# EAGLE design mcu (EAGLE 7.3.0)
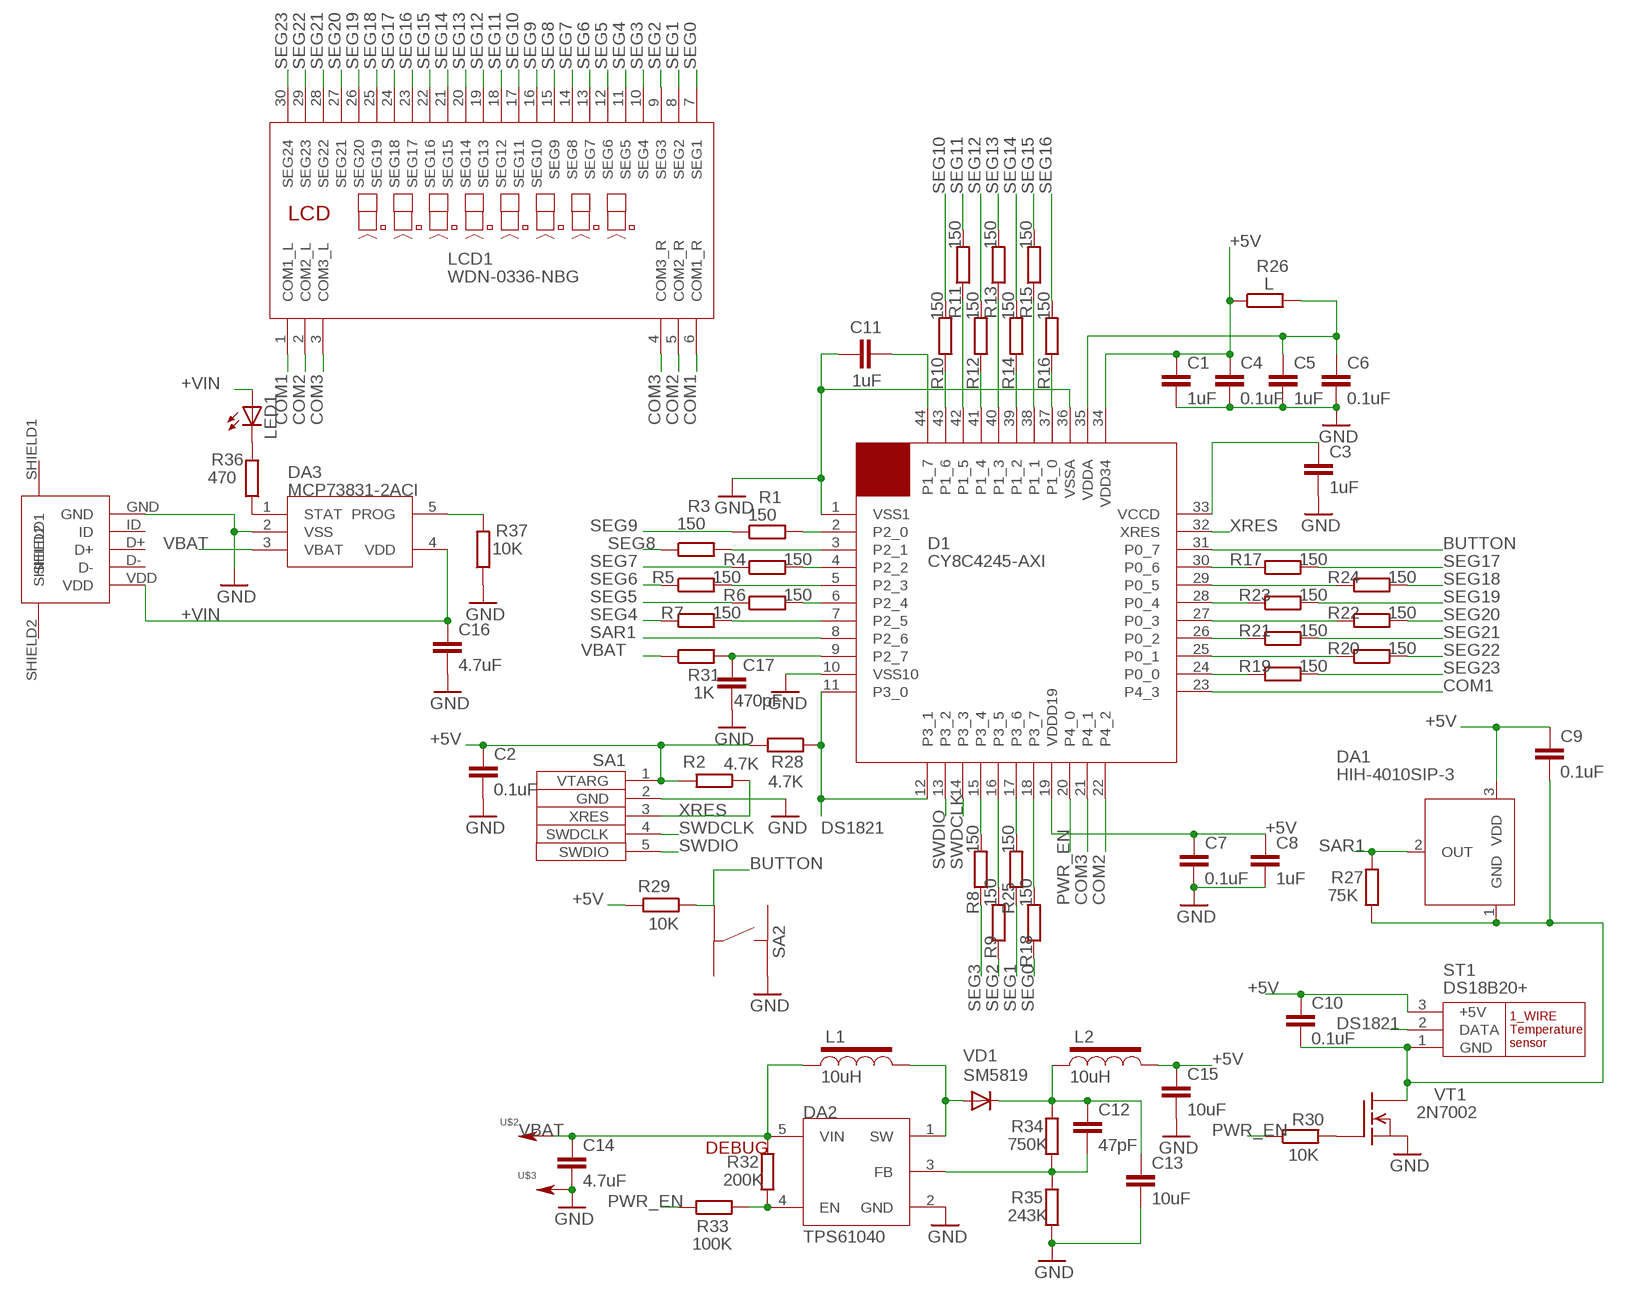
[diagram p0: schematic, sheet 1]

## Parts
C1  1uF  C-EUC0603  [C0603]
C2  0.1uF  C-EUC0603  [C0603]
C3  1uF  C-EUC0603  [C0603]
C4  0.1uF  C-EUC0603  [C0603]
C5  1uF  C-EUC0603  [C0603]
C6  0.1uF  C-EUC0603  [C0603]
C7  0.1uF  C-EUC0603  [C0603]
C8  1uF  C-EUC0603  [C0603]
C9  0.1uF  C-EUC0603  [C0603]
C10  0.1uF  C-EUC0603  [C0603]
C11  1uF  C-EUC0603  [C0603]
C12  47pF  C-EUC0805  [C0805]
C13  10uF  C-EUC0805  [C0805]
C14  4.7uF  C-EUC0805  [C0805]
C15  10uF  C-EUC0805  [C0805]
C16  4.7uF  C-EUC0805  [C0805]
C17  470pF  C-EUC0603  [C0603]
D1  CY8C4245-AXI  CY8C4245-AXITQFP44  [TQFP44]
DA1  HIH-4010SIP-3  [SIP-3]
DA2  TPS61040  [SOT23-5L]
DA3  MCP73831-2ACI  MCP73831SOT23-5  [SOT23-5L]
L1  10uH  INDUCTOR453226  [SQC453226]
L2  10uH  INDUCTOR453226  [SQC453226]
LCD1  WDN-0336-NBG  WDN0336HOLE  [WDN0336]
LED1  LEDSMT1206  [1206]
R1  150  R-EU_R0603  [R0603]
R2  4.7K  R-EU_R0603  [R0603]
R3  150  R-EU_R0603  [R0603]
R4  150  R-EU_R0603  [R0603]
R5  150  R-EU_R0603  [R0603]
R6  150  R-EU_R0603  [R0603]
R7  150  R-EU_R0603  [R0603]
R8  150  R-EU_R0603  [R0603]
R9  150  R-EU_R0603  [R0603]
R10  150  R-EU_R0603  [R0603]
R11  150  R-EU_R0603  [R0603]
R12  150  R-EU_R0603  [R0603]
R13  150  R-EU_R0603  [R0603]
R14  150  R-EU_R0603  [R0603]
R15  150  R-EU_R0603  [R0603]
R16  150  R-EU_R0603  [R0603]
R17  150  R-EU_R0603  [R0603]
R18  150  R-EU_R0603  [R0603]
R19  150  R-EU_R0603  [R0603]
R20  150  R-EU_R0603  [R0603]
R21  150  R-EU_R0603  [R0603]
R22  150  R-EU_R0603  [R0603]
R23  150  R-EU_R0603  [R0603]
R24  150  R-EU_R0603  [R0603]
R25  150  R-EU_R0603  [R0603]
R26  L  R-EU_R0805  [R0805]
R27  75K  R-EU_R0603  [R0603]
R28  4.7K  R-EU_R0603  [R0603]
R29  10K  R-EU_R0603  [R0603]
R30  10K  R-EU_R0603  [R0603]
R31  1K  R-EU_R0603  [R0603]
R32  200K  R-EU_R0603  [R0603]
R33  100K  R-EU_R0603  [R0603]
R34  750K  R-EU_R0805  [R0805]
R35  243K  R-EU_R0805  [R0805]
R36  470  R-EU_R1206  [R1206]
R37  10K  R-EU_R0603  [R0603]
SA1  SWDSWD-5  [SWD-5]
SA2  TACKT_BUTTONIIT-1102S  [IIT-1102S]
ST1  DS18B20+  DS18B20TO92  [TO92-]
U$1  USB-MICRO  [USB-MICRO-SMD]
U$2  1-PINHOME  [1-PIN_HOME]
U$3  1-PIN2_54  [1_PIN_2_54]
VD1  SM5819  SM5819MELF  [MELF-MLL41]
VT1  2N7002  [SOT23]

## Nets
+5V: C1.1 C2.1 C4.1 C7.1 C8.1 C9.1 C10.1 C15.1 D1.19(VDDD19) D1.34(VDD34) DA1.3(VDD) L2.2(L2) R2.2 R26.1 R28.2 R29.2 SA1.1(VTARG) ST1.3(+5V)
+VIN: C16.1 DA3.4(VDD) LED1.A U$1.VDD
BUTTON: D1.31(P0_7) R29.1 SA2.SSR
COM1: D1.23(P4_3) LCD1.1(COM1_L) LCD1.6(COM1_R)
COM2: D1.22(P4_2) LCD1.2(COM2_L) LCD1.5(COM2_R)
COM3: D1.21(P4_1) LCD1.3(COM3_L) LCD1.4(COM3_R)
DS1821: D1.11(P3_0) D1.12(P3_1) R28.1 ST1.2(DATA)
GND: C1.2 C2.2 C3.2 C4.2 C5.2 C6.2 C7.2 C8.2 C11.1 C13.2 C14.2 C15.2 C16.2 C17.2 D1.1(VSS1) D1.10(VSS10) D1.36(VSSA) DA2.2(GND) DA3.2(VSS) R35.1 R37.1 SA1.2(GND) SA2.SL U$1.GND U$3.P$1(S) VT1.2(S)
N$1: D1.2(P2_0) R1.2
N$2: D1.4(P2_2) R4.2
N$3: D1.6(P2_4) R6.2
N$4: D1.15(P3_4) R8.2
N$5: D1.3(P2_1) R3.2
N$6: D1.5(P2_3) R5.2
N$7: D1.7(P2_5) R7.2
N$8: D1.43(P1_6) R10.1
N$9: C3.1 D1.33(VCCD)
N$10: D1.42(P1_5) R11.1
N$11: D1.41(P1_4) R12.1
N$12: C5.1 C6.1 D1.35(VDDA) R26.2
N$13: D1.40(P1_3) R13.1
N$14: D1.39(P1_2) R14.1
N$15: D1.38(P1_1) R15.1
N$16: D1.37(P1_0) R16.1
N$17: D1.30(P0_6) R17.1
N$18: D1.29(P0_5) R24.1
N$19: D1.28(P0_4) R23.1
N$20: D1.16(P3_5) R9.2
N$21: D1.17(P3_6) R25.2
N$22: D1.18(P3_7) R18.2
N$23: D1.27(P0_3) R22.1
N$24: D1.26(P0_2) R21.1
N$25: D1.25(P0_1) R20.1
N$26: D1.24(P0_0) R19.1
N$27: C11.2 D1.44(P1_7)
N$28: C9.2 C10.2 DA1.1(GND) R27.1 ST1.1(GND) VT1.3(D)
N$29: R30.2 VT1.1(G)
N$30: C12.2 DA2.3(FB) R34.1 R35.2
N$31: DA2.4(EN) R32.1 R33.2
N$32: DA2.1(SW) L1.2(L2) VD1.A
N$33: C12.1 C13.1 L2.1(L1) R34.2 VD1.C
N$34: DA3.1(STAT) R36.1
N$37: LED1.C R36.2
N$38: DA3.5(PROG) R37.2
PWR_EN: D1.20(P4_0) R30.1 R33.1
SAR1: D1.8(P2_6) DA1.2(OUT) R27.2
SAR2: C17.1 D1.9(P2_7) R31.2
SEG0: LCD1.7(SEG1) R18.1
SEG1: LCD1.8(SEG2) R25.1
SEG2: LCD1.9(SEG3) R9.1
SEG3: LCD1.10(SEG4) R8.1
SEG4: LCD1.11(SEG5) R7.1
SEG5: LCD1.12(SEG6) R6.1
SEG6: LCD1.13(SEG7) R5.1
SEG7: LCD1.14(SEG8) R4.1
SEG8: LCD1.15(SEG9) R3.1
SEG9: LCD1.16(SEG10) R1.1
SEG10: LCD1.17(SEG11) R10.2
SEG11: LCD1.18(SEG12) R11.2
SEG12: LCD1.19(SEG13) R12.2
SEG13: LCD1.20(SEG14) R13.2
SEG14: LCD1.21(SEG15) R14.2
SEG15: LCD1.22(SEG16) R15.2
SEG16: LCD1.23(SEG17) R16.2
SEG17: LCD1.24(SEG18) R17.2
SEG18: LCD1.25(SEG19) R24.2
SEG19: LCD1.26(SEG20) R23.2
SEG20: LCD1.27(SEG21) R22.2
SEG21: LCD1.28(SEG22) R21.2
SEG22: LCD1.29(SEG23) R20.2
SEG23: LCD1.30(SEG24) R19.2
SWDCLK: D1.14(P3_3) SA1.4(SWDCLK)
SWDIO: D1.13(P3_2) SA1.5(SWDIO)
VBAT: C14.1 DA2.5(VIN) DA3.3(VBAT) L1.1(L1) R31.1 R32.2 U$2.P$1(S)
XRES: D1.32(XRES) R2.1 SA1.3(XRES)
Unconnected: SA2.SR SA2.SSL U$1.D+ U$1.D- U$1.ID U$1.SHIELD1 U$1.SHIELD2

## Notes on the sheet
- DEBUG

## Library data of the parts
C1-C17 = resistors:C-EU: CAPACITOR, European symbol
D1 = cypress:CY8C4245-AXI
DA1 = Sensors:HIH-4010
DA2 = power:TPS61040
DA3 = power:MCP73831
L1 L2 = inductors:INDUCTOR
LCD1 = lcd:WDN0336
LED1 = led:LED: LED OSRAM: - CHIPLED LG R971, LG N971, LY N971, LG Q971, LY Q971, LO R971, LY R971 LH N974, LH R974 LS Q976, LO Q976, LY Q976 LO Q996 - Hyper CHIPLED LW Q18S LB Q993, LB Q99A, LB R99A - SideLED LS A670, LO A670, LY A670, LG A670, LP A670 LB A673, LV A673, LT A673, LW A673 LH A674 LY A675 LS A676, LA A676, LO A676, LY A676, LW A676 LS A679, LY A679, LG A679 - Hyper Micro SIDELED® LS Y876, LA Y876, LO Y876, LY Y876 LT Y87S - SmartLED LW L88C, LW L88S LB L89C, LB L89S, LG L890 LS L89K, LO L89K, LY L89K LS L896, LA L896, LO L896, LY L896 - TOPLED LS T670, LO T670, LY T670, LG T670, LP T670 LSG T670, LSP T670, LSY T670, LOP T670, LYG T670 LG T671, LOG T671, LSG T671 LB T673, LV T673, LT T673, LW T673 LH T674 LS T676, LA T676, LO T676, LY T676, LB T676, LH T676, LSB T676, LW T676 LB T67C, LV T67C, LT T67C, LS T67K, LO T67K, LY T67K, LW E67C LS E67B, LA E67B, LO E67B, LY E67B, LB E67C, LV E67C, LT E67C LW T67C LS T679, LY T679, LG T679 LS T770, LO T770, LY T770, LG T770, LP T770 LB T773, LV T773, LT T773, LW T773 LH T774 LS E675, LA E675, LY E675, LS T675 LS T776, LA T776, LO T776, LY T776, LB T776 LHGB T686 LT T68C, LB T68C - Hyper Mini TOPLED® LB M676 - Mini TOPLED Santana® LG M470 LS M47K, LO M47K, LY M47K Source: http://www.osram.convergy.de LUXEON: - LUMILED® LXK2-PW12-R00, LXK2-PW12-S00, LXK2-PW14-U00, LXK2-PW14-V00 LXK2-PM12-R00, LXK2-PM12-S00, LXK2-PM14-U00 LXK2-PE12-Q00, LXK2-PE12-R00, LXK2-PE12-S00, LXK2-PE14-T00, LXK2-PE14-U00 LXK2-PB12-K00, LXK2-PB12-L00, LXK2-PB12-M00, LXK2-PB14-N00, LXK2-PB14-P00, LXK2-PB14-Q00 LXK2-PR12-L00, LXK2-PR12-M00, LXK2-PR14-Q00, LXK2-PR14-R00 LXK2-PD12-Q00, LXK2-PD12-R00, LXK2-PD12-S00 LXK2-PH12-R00, LXK2-PH12-S00 LXK2-PL12-P00, LXK2-PL12-Q00, LXK2-PL12-R00 Source: www.luxeon.com KINGBRIGHT: KA-3528ASYC Source: www.kingbright.com
R1-R37 = resistors:R-EU_: RESISTOR, European symbol
SA1 = cypress:SWD
SA2 = button:TACKT_BUTTON
ST1 = Sensors:DS18B20
U$1 = connectors:USB-MICRO
U$2 U$3 = connectors:1-PIN
VD1 = diodes:SM5819
VT1 = Tranzistors:2N7002

## Board
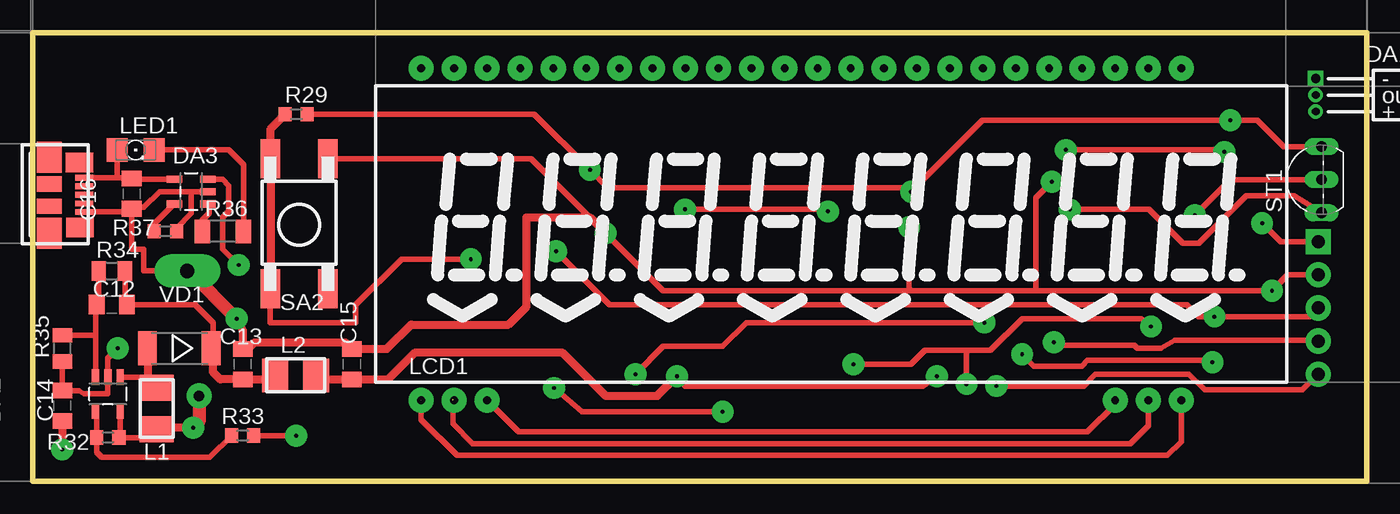
[diagram p1: board, top side]
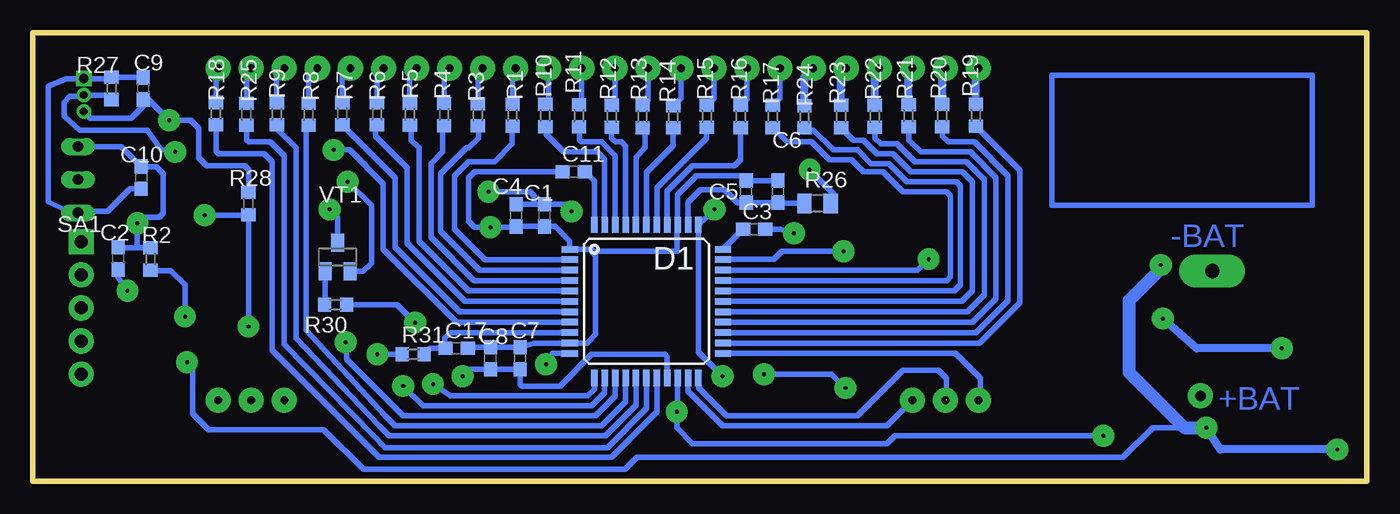
[diagram p2: board, bottom side, seen from below]

Size 102.55 x 34.47 mm. Coordinates in mm from the lower left corner, seen from the top.
Outline: 102.55,34.47 0,34.47 0,0 102.55,0 102.55,34.47
Copper layers (1*16): Top 0.035mm / dielectric 1.5mm / Bottom 0.035mm
Design rules "default": minimum track width 10mil, minimum drill 24mil, track to track 8mil, track to pad 8mil, pad to pad 8mil, via to via 8mil, smd to smd 8mil, copper to edge 40mil, drill to drill 8mil, minimum pad ring 10mil, minimum via ring 8mil, stop-mask expansion 4mil, vias tented up to drill 0mil, thermal gap 10mil

### Footprints (pad centres in the part's own frame; a part is rotated, then mirrored left to right if it is on the bottom)
C0603 = smd 1.1 x 1: 1 -0.85,0; 2 0.85,0
C0805 = smd 1.2 x 1.5: 1 -1.167,0; 2 1.167,0
TQFP44 = smd 1.25 x 0.5: 1 -5.879,4; 2 -5.879,3.2; 3 -5.879,2.4; 4 -5.879,1.6; 5 -5.879,0.8; 6 -5.879,0; 7 -5.879,-0.8; 8 -5.879,-1.6; 9 -5.879,-2.4; 10 -5.879,-3.2; 11 -5.879,-4; 23 5.879,-4; 24 5.879,-3.2; 25 5.879,-2.4; 26 5.879,-1.6; 27 5.879,-0.8; 28 5.879,0; 29 5.879,0.8; 30 5.879,1.6; 31 5.879,2.4; 32 5.879,3.2; 33 5.879,4 | smd 0.5 x 1.25: 12 -4,-5.879; 13 -3.2,-5.879; 14 -2.4,-5.879; 15 -1.6,-5.879; 16 -0.8,-5.879; 17 0,-5.879; 18 0.8,-5.879; 19 1.6,-5.879; 20 2.4,-5.879; 21 3.2,-5.879; 22 4,-5.879; 34 4,5.879; 35 3.2,5.879; 36 2.4,5.879; 37 1.6,5.879; 38 0.8,5.879; 39 0,5.879; 40 -0.8,5.879; 41 -1.6,5.879; 42 -2.4,5.879; 43 -3.2,5.879; 44 -4,5.879
SIP-3 = drill 0.7 pad 1 square: 1 0,0 | drill 0.6 pad 1: 2 0,-1.27; 3 0,-2.54
SOT23-5L = smd 0.55 x 1.2: 1 -0.95,-1.3; 2 0,-1.3; 3 0.95,-1.3; 4 0.95,1.3; 5 -0.95,1.3
SQC453226 = smd 2 x 2.6: 1 0.953,1.27; 2 4.128,1.27
WDN0336 = drill 0.6 pad 1.93: 1 3.493,0.535; 2 6.032,0.535; 3 8.572,0.535; 4 56.833,0.535; 5 59.373,0.535; 6 61.913,0.535; 7 61.913,26.035; 8 59.373,26.035; 9 56.833,26.035; 10 54.292,26.035; 11 51.752,26.035; 12 49.212,26.035; 13 46.672,26.035; 14 44.133,26.035; 15 41.593,26.035; 16 39.053,26.035; 17 36.513,26.035; 18 33.972,26.035; 19 31.433,26.035; 20 28.892,26.035; 21 26.352,26.035; 22 23.812,26.035; 23 21.273,26.035; 24 18.733,26.035; 25 16.192,26.035; 26 13.652,26.035; 27 11.113,26.035; 28 8.572,26.035; 29 6.032,26.035; 30 3.493,26.035
1206 = smd 1.6 x 1.803: A -1.422,0; C 1.422,0
R0603 = smd 1 x 1.1: 1 -0.85,0; 2 0.85,0
R0805 = smd 1.1 x 1.5: 1 -1.009,0; 2 1.009,0
R1206 = smd 1.2 x 1.803: 1 -1.581,0; 2 1.581,0
SWD-5 = drill 1 pad 1.93 square: 1 0,0 | drill 1 pad 1.93: 2 2.54,0; 3 5.08,0; 4 7.62,0; 5 10.16,0
IIT-1102S = smd 3 x 1.5: SL 10.001,0; SR 0,0; SSL 0,4.445; SSR 10.001,4.445
TO92- = drill 0.813 long: 1 -2.54,0; 2 0,0; 3 2.54,0
USB-MICRO-SMD = smd 1.38 x 0.45: D+ 0,-1.627; D- 0,-0.972; GND 0,-2.937; ID 0,-2.282; VDD 0,-0.318 | smd 2.1 x 1.5: P$1 -0.318,-4.128; P$2 -0.357,0.853 | smd 1.9 x 1.175: P$5 -2.679,-2.5; P$6 -2.679,-0.794 | smd 1.9 x 2.375: SHIELD1 -2.679,1.27; SHIELD2 -2.679,-4.564
1-PIN_HOME = drill 0.8 pad 1.93: P$1 0,0
1_PIN_2_54 = drill 1.1 pad 2.54 long: P$1 0,0
MELF-MLL41 = smd 1.45 x 2.6: A 2.445,0; C -2.445,0
SOT23 = smd 1 x 1.4: 1 -0.95,-1.1; 2 0.95,-1.1; 3 0,1.1

### Placement (x,y rotation side)
C1  63.2,20.42 270 bottom
C2  95.96,17.12 270 bottom
C3  47.09,19.35 0 bottom
C4  65.38,20.42 270 bottom
C5  47.7,22.25 90 bottom
C6  45.26,22.25 90 bottom
C7  65.07,9.45 90 bottom
C8  67.36,9.45 90 bottom
C9  94.03,30.18 90 bottom
C10  94.18,23.32 270 bottom
C11  60.96,23.77 0 bottom
C12  6.1,13.56 180 top
C13  16.15,8.99 90 top
C14  2.29,5.79 90 top
C15  24.54,8.99 90 top
C16  7.62,22.1 270 top
C17  69.95,10.21 0 bottom
D1  55.37,13.82 0 bottom
DA1  98.6,30.94 0 top
DA2  5.79,6.71 180 top
DA3  12.19,22.25 90 top
L1  10.82,3.05 90 top
L2  17.68,6.86 0 top
LCD1  26.37,5.69 0 top
LED1  7.92,25.45 0 top
R1  65.66,28.12 270 bottom
R2  93.47,17.07 90 bottom
R3  68.33,28.14 270 bottom
R4  70.92,28.17 270 bottom
R5  73.56,28.19 270 bottom
R6  76.07,28.22 270 bottom
R7  78.74,28.24 270 bottom
R8  81.33,28.19 270 bottom
R9  83.77,28.22 270 bottom
R10  63.14,28.09 90 bottom
R11  60.55,28.07 90 bottom
R12  58.04,28.04 90 bottom
R13  55.68,28.02 90 bottom
R14  53.31,27.99 90 bottom
R15  50.72,28.04 90 bottom
R16  48.13,28.02 90 bottom
R17  45.67,28.02 90 bottom
R18  88.44,28.24 270 bottom
R19  30.05,28.12 90 bottom
R20  32.64,28.09 90 bottom
R21  35.23,28.07 90 bottom
R22  37.82,28.04 90 bottom
R23  40.41,28.02 90 bottom
R24  43.23,27.99 90 bottom
R25  86.11,28.19 270 bottom
R26  42.21,21.34 180 bottom
R27  96.47,30.18 270 bottom
R28  85.95,21.34 90 bottom
R29  20.27,28.19 0 top
R30  79.25,13.56 180 bottom
R31  73.3,9.75 0 bottom
R32  5.79,3.35 0 top
R33  16.15,3.51 180 top
R34  6.1,16.15 0 top
R35  2.29,10.21 90 top
R36  14.63,19.2 0 top
R37  10.21,19.2 180 top
SA1  98.81,18.39 270 bottom
SA2  22.71,14.78 90 top
ST1  99.06,23.16 90 top
U$1  3.96,23.62 0 top
U$2  12.8,6.55 0 top
U$3  11.89,16.15 90 top
VD1  11.28,10.21 180 top
VT1  79.1,17.22 0 bottom

### Tracks (layer width: path | path; a pad name or v marks a point on that pad's centre or on a via)
+5V  (via drill 0.3 pad 1.68)
  Top 0.406: SA1.1 95.91,18.39 v94.49,19.81 | v49.53,8.08 50.14,7.32 68.43,7.32 v69.49,8.08 | ST1.3 96.16,25.7 94.13,27.74 v92.05,27.74 73,27.74 v67.51,22.25 67.21,22.55 44.2,22.55 v42.82,23.93 38.56,28.19 R29.2 | v50.14,20.88 60.96,20.88 v61.11,20.73
  Top 0.61: L2.2 22.11,7.82 C15.1 27.33,7.82 29.41,9.91 40.69,9.91 44.04,6.55 48.01,6.55 v49.53,8.08
  Bottom 0.406: C2.1 95.91,17.92 94.64,17.92 | 94.64,17.92 R2.2 | 94.64,17.92 94.49,18.07 v94.49,19.81 94.03,20.27 92.81,20.27 92.51,20.57 92.51,23.62 93.05,24.17 C10.1 95.72,25.7 ST1.3 | v50.14,20.88 50.71,20.31 D1.34 51.37,9.92 v49.53,8.08 | 64.01,21.27 C1.1 61.35,21.27 v61.11,20.73 | C4.1 64.01,21.27 | v67.51,22.25 64.31,22.25 64.01,21.95 64.01,21.27 | D1.19 53.77,9.58 53.95,9.75 59.59,9.75 62.03,7.32 64.92,7.32 65.08,7.47 C7.1 C8.1 68.97,8.6 v69.49,8.08 | R26.1 41,21.34 41,22.1 v42.82,23.93 | DA1.3 98.09,27.89 94.94,27.89 94.03,28.8 C9.1 93.64,29.32 v92.05,27.74 90.37,27.74 89.76,27.13 89.76,24.84 89.15,24.23 86.26,24.23 85.95,23.93 R28.2
+VIN
  Top 0.406: U$1.VDD 6.4,23.3 | 6.4,23.3 7.58,23.3 C16.1 7.68,23.2 DA3.4 | LED1.A 6.5,23.41 6.4,23.3
BUTTON  (via drill 0.3 pad 1.68)
  Top 0.406: v33.68,17.07 28.35,17.07 24.84,13.56 24.84,12.19 18.26,12.19 SA2.SSR
  Top 0.61: R29.1 18.26,27.04 SA2.SSR
  Bottom 0.406: D1.31 34.53,16.22 v33.68,17.07
COM1  (1 unrouted)
  Top 0.406: LCD1.6 88.28,3.05 87.21,1.98 32.61,1.98 29.87,4.72 LCD1.1
  Bottom 0.406: 29.87,6.24 LCD1.1 29.72,6.36 29.72,7.92 31.61,9.82 D1.23
COM2  (1 unrouted)
  Top 0.406: LCD1.5 85.74,4.27 84.37,2.9 33.83,2.9 32.31,4.42 32.31,6.22
  Bottom 0.406: LCD1.2 32.31,6.31 32.31,7.92 32.92,8.53 35.66,8.53 39.17,5.03 49.23,5.03 51.37,7.18 D1.22
COM3
  Top 0.406: LCD1.4 83.2,5.93 81.08,3.81 37.35,3.81 LCD1.3
  Bottom 0.406: 34.96,6.25 LCD1.3 36.9,4.27 49.53,4.27 52.17,6.91 D1.21
DS1821  (via drill 0.3 pad 1.68)
  Top 0.406: v85.95,11.89 85.19,12.5 76.05,12.5 73.61,10.06 71.93,10.06 71.78,9.91 | ST1.2 92.05,23.16 v89.31,20.42 | v63.09,8.99 67.51,8.99 68.58,10.06 71.78,10.06 71.78,9.91 | v71.78,7.47 71.78,9.91
  Bottom 0.406: D1.11 62.57,9.82 v63.09,8.99 | v85.95,11.89 R28.1 86.02,20.42 v89.31,20.42 | D1.12 59.37,7.07 59.89,6.55 70.41,6.55 v71.78,7.47
GND  (via drill 0.3 pad 1.68)
  Top 0.406: 77.11,14.63 v95.25,14.63 96.47,15.85 SA1.2 | 77.11,14.63 67.51,14.63 | 67.51,14.63 48.46,14.63 v44.04,19.05 | 43.89,19.2 v44.04,19.05 | v78.33,23.01 77.11,21.79 77.11,14.63 | v44.04,19.05 38.31,24.78 SA2.SL | v67.36,19.51 67.36,14.78 67.51,14.63 | R35.1 C14.2 3.56,6.96 3.96,6.71 5.79,6.71 DA2.2 5.79,9.45 v6.55,10.21 | U$1.GND 7.62,20.68 C16.2 | DA3.2 12.19,22.25 | 12.19,22.25 9.75,22.25 8.53,21.03 7.72,21.03 C16.2 | U$3.P$1 8.53,16.15 8.53,17.83 7.62,17.83 C16.2 | R37.1 11.06,19.44 12.19,20.57 12.19,22.25
  Top 0.61: v44.04,19.05 42.82,20.27 37.95,20.27 37.95,13.41 36.58,12.04 29.11,12.04 27.23,10.16 C15.2 24.03,10.67 17.07,10.67 16.56,10.16 C13.2 16.15,11.58 v15.7,12.5
  Top 1.016: U$3.P$1 12.04,16.15 v15.7,12.5
  Bottom 0.406: 59.59,17.68 59.59,17.83 D1.1 61.27,17.83 61.27,18.44 62.4,19.57 C1.2 C4.2 65.29,19.51 v67.36,19.51 68.58,19.51 69.04,19.96 69.04,23.32 68.58,23.77 C11.1 | C6.2 C5.2 48.07,23.47 51.51,23.47 52.97,22.01 D1.36 53.03,19.63 53.03,17.68 59.59,17.68 | C3.2 45.11,19.36 v44.04,19.05 | 59.59,17.68 59.28,17.37 59.28,11.28 59.94,10.62 D1.10 63.99,10.62 C7.2 C8.2 69.01,10.3 C17.2 | C2.2 95.96,15.65 v95.25,14.63 | VT1.2 77.15,16.12 76.5,16.76 76.5,21.18 v78.33,23.01
  Bottom 0.61: v6.55,10.21 13.11,10.21 v15.7,12.5
N$1
  Bottom 0.406: D1.2 67.77,17.02 70.1,19.36 70.1,23.47 69.04,24.54 67.06,24.54 65.68,25.91 65.68,27.24 R1.2
N$2
  Bottom 0.406: 70.87,27.27 R4.2 71.02,27.22 71.02,25.3 71.93,24.38 71.93,18.75 68.61,15.42 D1.4
N$3
  Bottom 0.406: D1.6 69.29,13.82 73.76,18.29 73.76,24.08 76.2,26.52 76.2,27.24 R6.2 76.05,27.34
N$4
  Bottom 0.406: R8.2 81.53,27.14 81.53,11.58 75.44,5.03 74.68,4.27 58.83,4.27 56.97,6.12 D1.15
N$5
  Bottom 0.406: D1.3 68.19,16.22 71.17,19.2 71.17,23.62 69.19,25.6 69.04,25.6 68.28,26.36 68.28,27.24 R3.2
N$6
  Bottom 0.406: D1.5 69.02,14.62 72.85,18.44 72.85,25.6 73.46,26.21 73.46,27.24 R5.2
N$7
  Bottom 0.406: 78.79,27.34 R7.2 74.68,23.33 74.68,17.98 69.71,13.02 D1.7
N$8
  Bottom 0.406: D1.43 58.57,24.74 59.13,25.3 61.72,25.3 63.09,26.67 63.09,27.19 R10.1
N$9
  Bottom 0.406: D1.33 49.48,17.82 C3.1
N$10
  Bottom 0.406: D1.42 57.77,25.01 58.83,26.06 60.35,26.06 60.5,26.21 60.5,27.17 R11.1
N$11
  Bottom 0.406: D1.41 56.97,25.73 57.3,26.06 57.76,26.06 58.06,26.36 58.06,27.17 R12.1
N$12
  Bottom 0.406: D1.35 52.17,21.44 51.21,22.4 49.38,22.4 48.38,21.4 C5.1 C6.1 45.2,21.34 R26.2
N$13
  Bottom 0.406: D1.40 56.17,24.91 55.47,25.6 55.47,26.96 R13.1
N$14
  Bottom 0.406: D1.39 55.37,23.72 53.34,25.76 53.34,27.11 R14.1
N$15
  Bottom 0.406: D1.38 54.57,22.54 50.75,26.36 50.75,27.17 R15.1
N$16
  Bottom 0.406: D1.37 53.77,22.28 51.82,24.23 48.62,24.23 48.16,24.69 48.16,27.14 R16.1
N$17
  Bottom 0.406: D1.30 32.28,15.42 32,15.7 32,21.95 32.31,22.25 35.66,22.25 37.19,23.77 38.71,23.77 39.62,24.69 41.3,24.69 42.67,26.06 44.56,26.06 R17.1
N$18
  Bottom 0.406: D1.29 31.71,14.62 31.24,15.09 31.24,22.71 31.55,23.01 35.36,23.01 36.73,24.38 38.1,24.38 39.17,25.45 41,25.45 42.52,26.98 43.06,26.98 R24.1
N$19
  Bottom 0.406: D1.28 31.14,13.82 30.33,14.63 30.33,23.01 31.09,23.77 35.05,23.77 36.42,25.15 37.64,25.15 38.71,26.21 39.46,26.21 R23.1
N$20
  Bottom 0.406: R9.2 83.77,27.08 82.3,25.6 82.3,10.97 75.89,4.27 75.13,3.5 58.52,3.5 56.17,5.86 D1.16
N$21
  Bottom 0.406: R25.2 86.11,26.21 85.95,26.06 84.28,26.06 83.21,24.99 83.21,10.52 76.35,3.5 75.44,2.59 58.37,2.59 55.37,5.59 D1.17
N$22
  Bottom 0.406: R18.2 88.44,25.35 88.24,25.15 84.73,25.15 84.12,24.54 84.12,10.06 75.89,1.83 58.06,1.83 54.57,5.32 D1.18
N$23
  Bottom 0.406: D1.27 30.72,13.02 29.41,14.33 29.41,23.16 30.79,24.54 34.75,24.54 36.12,25.91 37.34,25.91 37.8,26.36 37.8,27.17 R22.1
N$24
  Bottom 0.406: D1.26 30.3,12.22 28.5,14.02 28.5,23.32 30.48,25.3 34.29,25.3 35.2,26.21 35.2,27.19 R21.1
N$25
  Bottom 0.406: D1.25 30.04,11.42 27.58,13.87 27.58,23.47 30.18,26.06 32.16,26.06 32.61,26.52 32.61,27.22 R20.1
N$26
  Bottom 0.406: D1.24 29.77,10.62 26.67,13.72 26.67,23.89 R19.1
N$27
  Bottom 0.406: D1.44 59.37,23.04 C11.2
N$28  (via drill 0.3 pad 1.68)
  Top 0.406: v79.7,20.88 85.8,20.88 88.39,18.29 89.61,18.29 93.27,21.95 96.98,21.95 ST1.1
  Bottom 0.406: C9.2 R27.1 96.56,30.94 DA1.1 99.97,30.94 101.35,30.33 101.35,21.49 99.82,20.73 98.86,20.73 ST1.1 98.65,20.73 96.77,20.73 95.03,22.47 C10.2 | VT1.3 79.1,20.27 v79.7,20.88
N$29
  Bottom 0.406: VT1.1 80.05,13.62 R30.2
N$30
  Top 0.406: R34.1 5.09,13.72 C12.2 4.84,13.48 4.84,11.12 | DA2.3 4.84,11.12 | R35.2 4.75,11.22 4.84,11.12
N$31
  Top 0.406: DA2.4 4.94,5.31 R32.1 4.94,2.22 5.33,1.83 13.63,1.83 R33.2
N$32
  Top 0.406: DA2.1 8.75,8.01 8.83,7.92
  Top 0.61: VD1.A 8.83,7.92 8.83,7.89 L1.2
N$33
  Top 0.406: VD1.C 13.87,10.36 13.87,12.19 12.5,13.56 C12.1 7.11,13.72 R34.2
  Top 0.61: 18.58,8.08 L2.1 18.33,7.82 C13.1 14.43,7.82 13.87,8.38 13.87,10.06 VD1.C
N$34
  Top 0.406: 13.49,21.18 DA3.1 13.56,21.23 13.56,20.57 13.05,20.06 R36.1
N$35
  Top 0.61: 18.14,24.84 18.29,24.84 18.29,14.63
N$36
  Bottom 0.406: 24.22,21.2 4.22,21.2 4.22,31.2 24.22,31.2 24.22,21.2
N$37
  Top 0.406: 9.5,25.6 LED1.C 15.09,25.45 16.21,24.33 R36.2
N$38
  Top 0.406: 10.97,21.22 DA3.5 | 10.73,21.14 DA3.5 | R37.2 9.36,19.77 DA3.5
PWR_EN  (via drill 0.3 pad 1.68)
  Top 0.406: v73.15,12.19 54.86,12.19 53.03,10.36 48.46,10.36 v46.33,8.23 | R33.1 v20.27,3.5 | v40.08,7.16 42.22,5.33 v53.03,5.33
  Bottom 0.406: D1.20 52.97,5.55 v53.03,5.33 53.03,4.12 51.82,2.9 36.88,2.9 36.27,3.5 v20.27,3.5 | R30.1 74.52,13.56 v73.15,12.19 | v46.33,8.23 41.15,8.23 v40.08,7.16
SAR1  (via drill 0.3 pad 1.68)
  Top 0.406: v79.4,25.45 91.44,25.45 v91.59,25.3
  Bottom 0.406: R27.2 96.81,29.67 DA1.2 98.7,29.57 99.67,29.57 100.13,29.11 100.13,28.04 98.91,26.98 93.73,26.98 92.66,25.45 v91.59,25.3 | D1.8 69.98,12.22 75.59,17.83 75.59,22.86 78.18,25.45 v79.4,25.45
SAR2
  Bottom 0.406: D1.9 70.42,11.42 70.87,10.97 70.87,10.28 C17.1 72,10.21 R31.2
SEG0
  Bottom 0.406: R18.1 88.44,31.56 LCD1.7
SEG1
  Bottom 0.406: R25.1 86.11,31.36 LCD1.8
SEG2
  Bottom 0.406: R9.1 83.77,31.15 LCD1.9
SEG3
  Bottom 0.406: R8.1 81.33,31.05 LCD1.10
SEG4
  Bottom 0.406: R7.1 78.74,31.1 LCD1.11
SEG5
  Bottom 0.406: R6.1 76.07,31.23 LCD1.12
SEG6
  Bottom 0.406: R5.1 73.56,31.2 LCD1.13
SEG7
  Bottom 0.406: R4.1 70.92,31.3 LCD1.14
SEG8
  Bottom 0.406: R3.1 68.33,31.36 LCD1.15
SEG9
  Bottom 0.406: R1.1 65.66,31.48 LCD1.16
SEG10
  Bottom 0.406: R10.2 62.88,29.21 LCD1.17
SEG11
  Bottom 0.406: R11.2 60.34,29.13 LCD1.18
SEG12
  Bottom 0.406: R12.2 57.8,29.13 LCD1.19
SEG13
  Bottom 0.406: R13.2 55.26,29.29 LCD1.20
SEG14
  Bottom 0.406: R14.2 52.72,29.44 LCD1.21
SEG15
  Bottom 0.406: R15.2 50.18,29.44 LCD1.22
SEG16
  Bottom 0.406: R16.2 47.64,29.36 LCD1.23
SEG17
  Bottom 0.406: R17.2 45.1,29.44 LCD1.24
SEG18
  Bottom 0.61: R24.2 43.23,31.05 LCD1.25
SEG19
  Bottom 0.61: R23.2 40.41,31.33 LCD1.26
SEG20
  Bottom 0.61: R22.2 37.82,31.38 LCD1.27
SEG21
  Bottom 0.61: R21.2 35.23,31.43 LCD1.28
SEG22
  Bottom 0.61: R20.2 32.64,31.48 LCD1.29
SEG23
  Bottom 0.61: R19.2 30.05,31.53 LCD1.30
SWDCLK  (via drill 0.3 pad 1.68)
  Top 0.406: SA1.4 98.75,10.82 87.78,10.82 86.72,10.21 84.89,10.21 84.66,10.44 78.72,10.44 v78.49,10.67
  Bottom 0.406: D1.14 57.77,6.54 59.28,5.03 74.07,5.03 78.41,9.37 78.41,10.59 v78.49,10.67
SWDIO  (via drill 0.3 pad 1.68)
  Top 0.406: v74.07,7.32 80.77,7.32 81.69,8.23 88.85,8.23 90.07,7.01 97.59,7.01 SA1.5
  Bottom 0.406: D1.13 58.57,6.81 59.59,5.79 72.54,5.79 v74.07,7.32
VBAT  (via drill 0.3 pad 1.68)
  Top 0.406: DA2.5 6.74,3.45 R32.2 8.9,3.35 L1.1 | v76.05,9.75 76.96,8.84 80.62,8.84 81.08,9.3 90.53,9.3 v90.68,9.14 | DA3.3 14.6,23.2 15.09,22.71 15.09,20.73 14.63,20.27 14.63,17.83 v15.85,16.61
  Top 0.61: C14.1 v2.29,2.44 | v12.34,4.12 9.66,4.12 L1.1
  Top 1.016: U$2.P$1 12.8,4.57 v12.34,4.12
  Bottom 0.406: 14.02,4.12 16.46,4.12 18.75,1.83 56.08,1.83 57,0.91 77.11,0.91 80.16,3.96 89,3.96 90.22,5.18 90.22,8.69 v90.68,9.14 | v76.05,9.75 R31.1
  Bottom 0.61: v2.29,2.44 11.28,2.44 v12.34,4.12
  Bottom 1.016: v15.85,16.61 15.85,16.31 18.29,13.87 18.29,8.38 14.02,4.12 v12.34,4.12
XRES  (via drill 0.3 pad 1.68)
  Top 0.406: v40.23,17.68 44.35,13.56 88.7,13.56 89.61,12.65 v90.83,12.65 98.15,12.65 SA1.3
  Bottom 0.406: R2.1 93.42,16.17 91.91,16.17 90.83,15.09 v90.83,12.65 | v40.23,17.68 44.96,17.68 45.57,17.07 49.44,17.07 D1.32

### Text on the board
Bottom: -BAT | +BAT